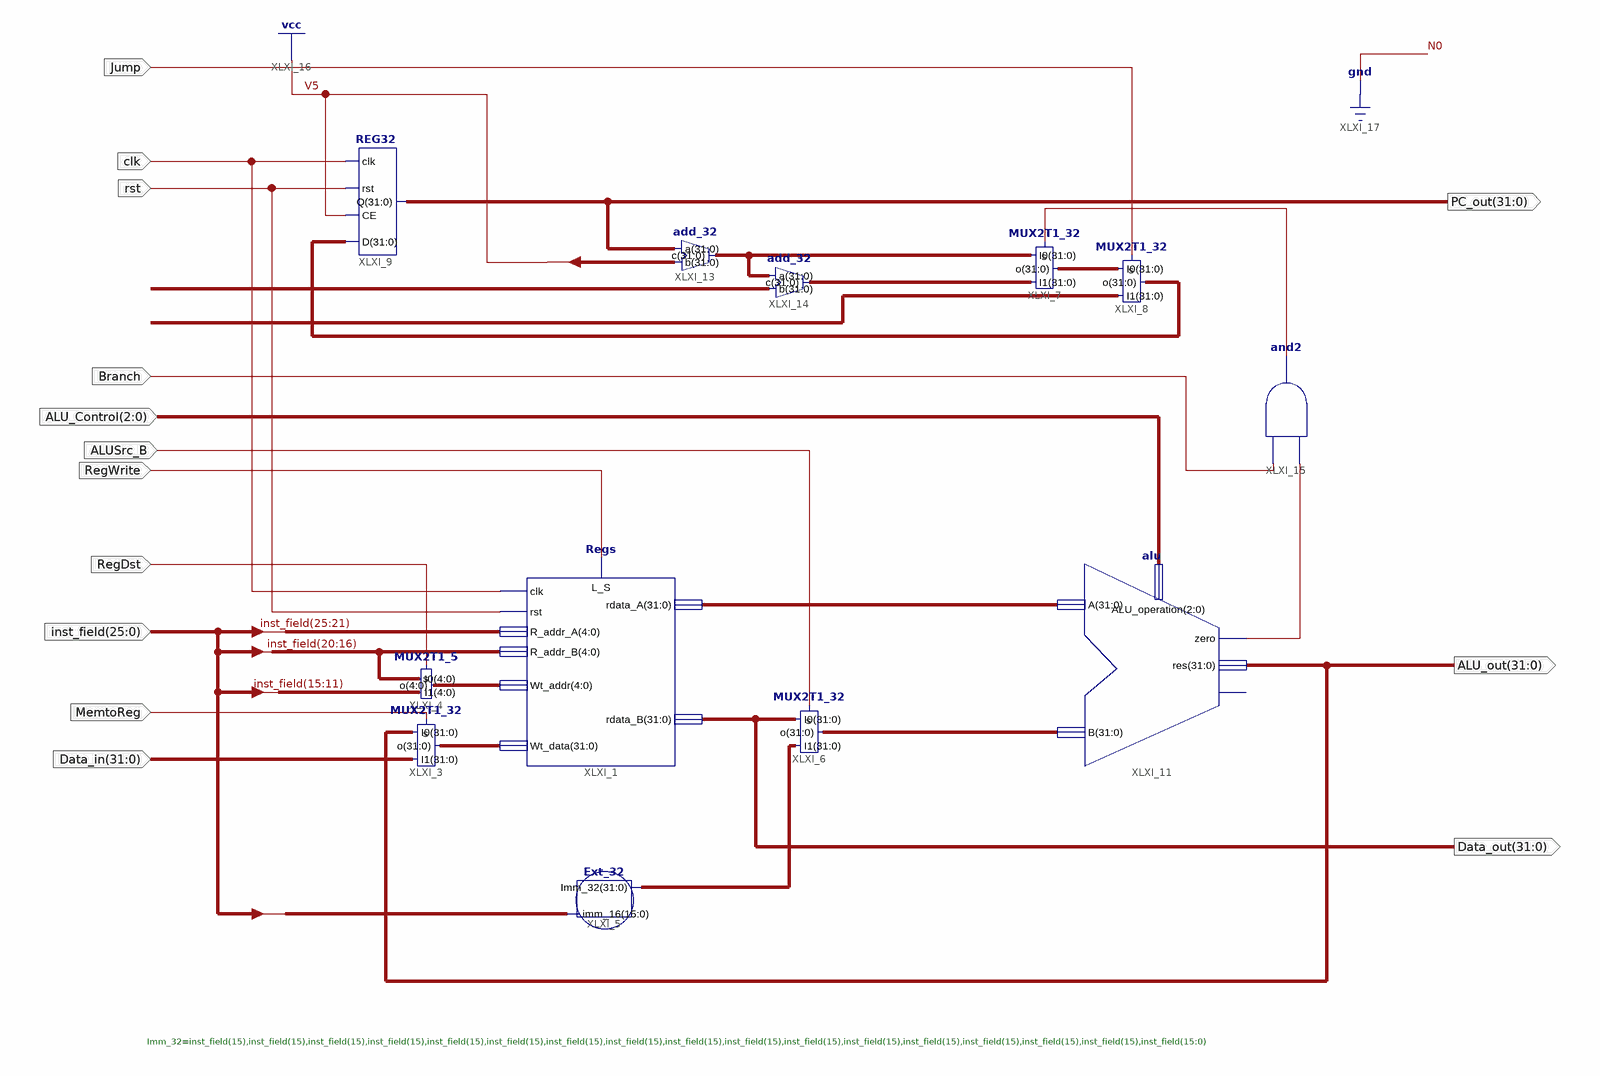
[diagram p0: schematic sheet 1]
// Xilinx ISE schematic Data_path1.sch (kintex7) as structural Verilog: 12 symbols, 14 ports
module Data_path1 (
  input  clk,
  input  rst,
  input  Jump,
  input  Branch,
  input  [2:0] ALU_Control,
  input  ALUSrc_B,
  input  RegWrite,
  input  RegDst,
  input  [25:0] inst_field,
  input  [31:0] Data_in,
  input  MemtoReg,
  output [31:0] PC_out,
  output [31:0] ALU_out,
  output [31:0] Data_out
);

  wire XLXN_14, XLXN_19;
  wire [4:0] Wt_addr;
  wire [31:0] branch_addr, Imm_32, pc_4, XLXN_13, XLXN_15, XLXN_23, XLXN_25, XLXN_44;

  Regs XLXI_1 (
    .clk(clk), .L_S(RegWrite), .rdata_A(XLXN_23), .rst(rst), .Wt_data(XLXN_44), .rdata_B(Data_out),
    .R_addr_A(inst_field[25:21]), .R_addr_B(inst_field[20:16]), .Wt_addr(Wt_addr));
  MUX2T1_32 XLXI_3 (.s(MemtoReg), .I0(ALU_out), .I1(Data_in), .o(XLXN_44));
  MUX2T1_5 XLXI_4 (.I1(inst_field[15:11]), .I0(inst_field[20:16]), .o(Wt_addr), .s(RegDst));
  Ext_32 XLXI_5 (.imm_16(inst_field[15:0]), .Imm_32(Imm_32));
  MUX2T1_32 XLXI_6 (.s(ALUSrc_B), .I0(Data_out), .I1(Imm_32), .o(XLXN_25));
  MUX2T1_32 XLXI_7 (.s(XLXN_14), .I0(pc_4), .I1(branch_addr), .o(XLXN_13));
  MUX2T1_32 XLXI_8 (.s(Jump), .I0(XLXN_13), .I1({pc_4[31:28], inst_field, 2'b00}), .o(XLXN_15));
  REG32 XLXI_9 (.D(XLXN_15), .CE(1'b1), .rst(rst), .clk(clk), .Q(PC_out));
  alu XLXI_11 (.zero(XLXN_19), .res(ALU_out), .A(XLXN_23), .B(XLXN_25), .ALU_operation(ALU_Control));  // open: overflow
  add_32 XLXI_13 (.c(pc_4), .a(PC_out), .b(32'b00000000000000000000000000000100));
  add_32 XLXI_14 (.c(branch_addr), .a(pc_4), .b({Imm_32[29:0], 2'b00}));
  and XLXI_15 (XLXN_14, XLXN_19, Branch);

  // Notes on the sheet:
  //   Imm_32=inst_field(15),inst_field(15),inst_field(15),inst_field(15),inst_field(15),inst_field(15),inst_field(15),inst_field(15),inst_field(15),inst_field(15),inst_field(15),inst_field(15),inst_field(15),inst_field(15),inst_field(15),inst_field(15),inst_field(15:0)
endmodule
